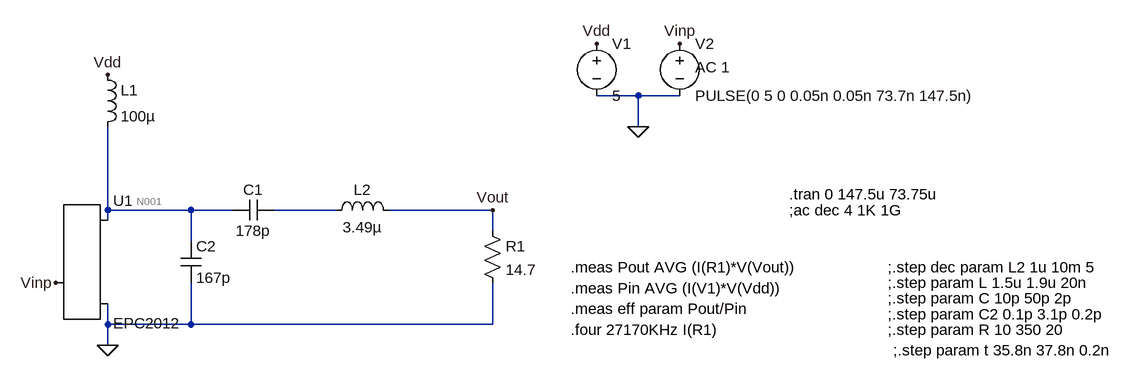
[diagram p0: schematic ClassE_6_78MHz.asc]
ClassE_6_78MHz.asc, the LTspice schematic file:
Version 4
SHEET 1 1216 680
WIRE 352 -112 288 -112
WIRE 416 -112 352 -112
WIRE 352 -64 352 -112
WIRE -464 64 -464 -64
WIRE -336 64 -464 64
WIRE -272 64 -336 64
WIRE -112 64 -208 64
WIRE 128 64 -32 64
WIRE -464 80 -464 64
WIRE 128 96 128 64
WIRE -336 112 -336 64
WIRE -464 240 -464 208
WIRE -336 240 -336 176
WIRE -336 240 -464 240
WIRE 128 240 128 176
WIRE 128 240 -336 240
WIRE -464 272 -464 240
FLAG -464 272 0
FLAG -464 -144 Vdd
FLAG -544 176 Vinp
FLAG 352 -64 0
FLAG 288 -192 Vdd
FLAG 416 -192 Vinp
FLAG 128 64 Vout
SYMBOL EPCGaN -544 176 R0
SYMATTR InstName U1
SYMATTR Value EPC2012
SYMBOL ind -480 -160 R0
SYMATTR InstName L1
SYMATTR Value 100µ
SYMATTR SpiceLine Rser=1
SYMBOL ind -128 80 R270
WINDOW 0 32 56 VTop 2
WINDOW 3 5 56 VBottom 2
SYMATTR InstName L2
SYMATTR Value 3.49µ
SYMATTR SpiceLine Rser=0.1
SYMBOL cap -208 48 R90
WINDOW 0 0 32 VBottom 2
WINDOW 3 32 32 VTop 2
SYMATTR InstName C1
SYMATTR Value 178p
SYMATTR SpiceLine Rser=0.1
SYMBOL res 112 80 R0
SYMATTR InstName R1
SYMATTR Value 14.7
SYMBOL voltage 288 -208 R0
WINDOW 123 0 0 Left 0
WINDOW 39 0 0 Left 0
SYMATTR InstName V1
SYMATTR Value 5
SYMBOL voltage 416 -208 R0
WINDOW 123 24 52 Left 2
WINDOW 39 0 0 Left 0
SYMATTR Value2 AC 1
SYMATTR InstName V2
SYMATTR Value PULSE(0 5 0 0.05n 0.05n 73.7n 147.5n)
SYMBOL cap -352 112 R0
SYMATTR InstName C2
SYMATTR Value 167p
SYMATTR SpiceLine Rser=0.1
TEXT 584 40 Left 2 !.tran 0 147.5u 73.75u
TEXT 584 64 Left 2 !;ac dec 4 1K 1G
TEXT 736 176 Left 2 !;.step param L 1.5u 1.9u 20n
TEXT 248 152 Left 2 !.meas Pout AVG (I(R1)*V(Vout))
TEXT 248 184 Left 2 !.meas Pin AVG (I(V1)*V(Vdd))
TEXT 248 216 Left 2 !.meas eff param Pout/Pin
TEXT 248 248 Left 2 !.four 27170KHz I(R1)
TEXT 736 248 Left 2 !;.step param R 10 350 20
TEXT 736 152 Left 2 !;.step dec param L2 1u 10m 5
TEXT 736 200 Left 2 !;.step param C 10p 50p 2p
TEXT 736 224 Left 2 !;.step param C2 0.1p 3.1p 0.2p
TEXT 744 280 Left 2 !;.step param t 35.8n 37.8n 0.2n

The netlist it stands for:
* ClassE_6_78MHz.asc
XU1 Vinp N001 0 EPC2012
L1 Vdd N001 100µ Rser=1
L2 N002 Vout 3.49µ Rser=0.1
C1 N002 N001 178p Rser=0.1
R1 Vout 0 14.7
V1 Vdd 0 5
V2 Vinp 0 PULSE(0 5 0 0.05n 0.05n 73.7n 147.5n) AC 1
C2 N001 0 167p Rser=0.1
.tran 0 147.5u 73.75u
;ac dec 4 1K 1G
;.step param L 1.5u 1.9u 20n
.meas Pout AVG (I(R1)*V(Vout))
.meas Pin AVG (I(V1)*V(Vdd))
.meas eff param Pout/Pin
.four 27170KHz I(R1)
;.step param R 10 350 20
;.step dec param L2 1u 10m 5
;.step param C 10p 50p 2p
;.step param C2 0.1p 3.1p 0.2p
;.step param t 35.8n 37.8n 0.2n
.backanno
.end

* Results of the author's LTspice run, read from the files saved beside the schematic
* Operating Point, zero values left out:
*   V(n001) = 5 V
*   V(vdd) = 5 V
*   I(L1) = 313.2 nA
*   I(V2) = 36.39 nA
*   I(V1) = -313.2 nA
*   Ix(u1:GATEIN) = -36.39 nA
*   Ix(u1:DRAININ) = 313.2 nA
*   Ix(u1:SOURCEIN) = -276.8 nA
* From the log:
*   N-Period=1
*   Fourier components of I(r1)
*   DC component:0.290248
*   Harmonic  Frequency   Fourier   Normalized   Phase    Normalized
*    Number     [Hz]     Component   Component  [degree]  Phase [deg]
*       1     2.717e+07  3.902e-02  1.000e+00     -8.70°      0.00°
*       2     5.434e+07  9.832e-03  2.520e-01     69.89°     78.59°
*       3     8.151e+07  4.768e-03  1.222e-01    156.10°    164.80°
*       4     1.087e+08  2.429e-03  6.225e-02   -119.28°   -110.58°
*       5     1.359e+08  1.617e-03  4.143e-02     -7.39°      1.31°
*       6     1.630e+08  1.725e-03  4.421e-02     26.03°     34.73°
*       7     1.902e+08  1.065e-03  2.730e-02    120.48°    129.18°
*       8     2.174e+08  8.157e-04  2.090e-02   -161.30°   -152.60°
*       9     2.445e+08  6.274e-04  1.608e-02    -75.47°    -66.77°
*   Total Harmonic Distortion: 29.562721%(29.795978%)
*   pout: AVG(i(r1)*v(vout))=0.725259 FROM 0 TO 7.375e-005
*   pin: AVG(i(v1)*v(vdd))=-0.793503 FROM 0 TO 7.375e-005
*   eff: pout/pin=-0.913996